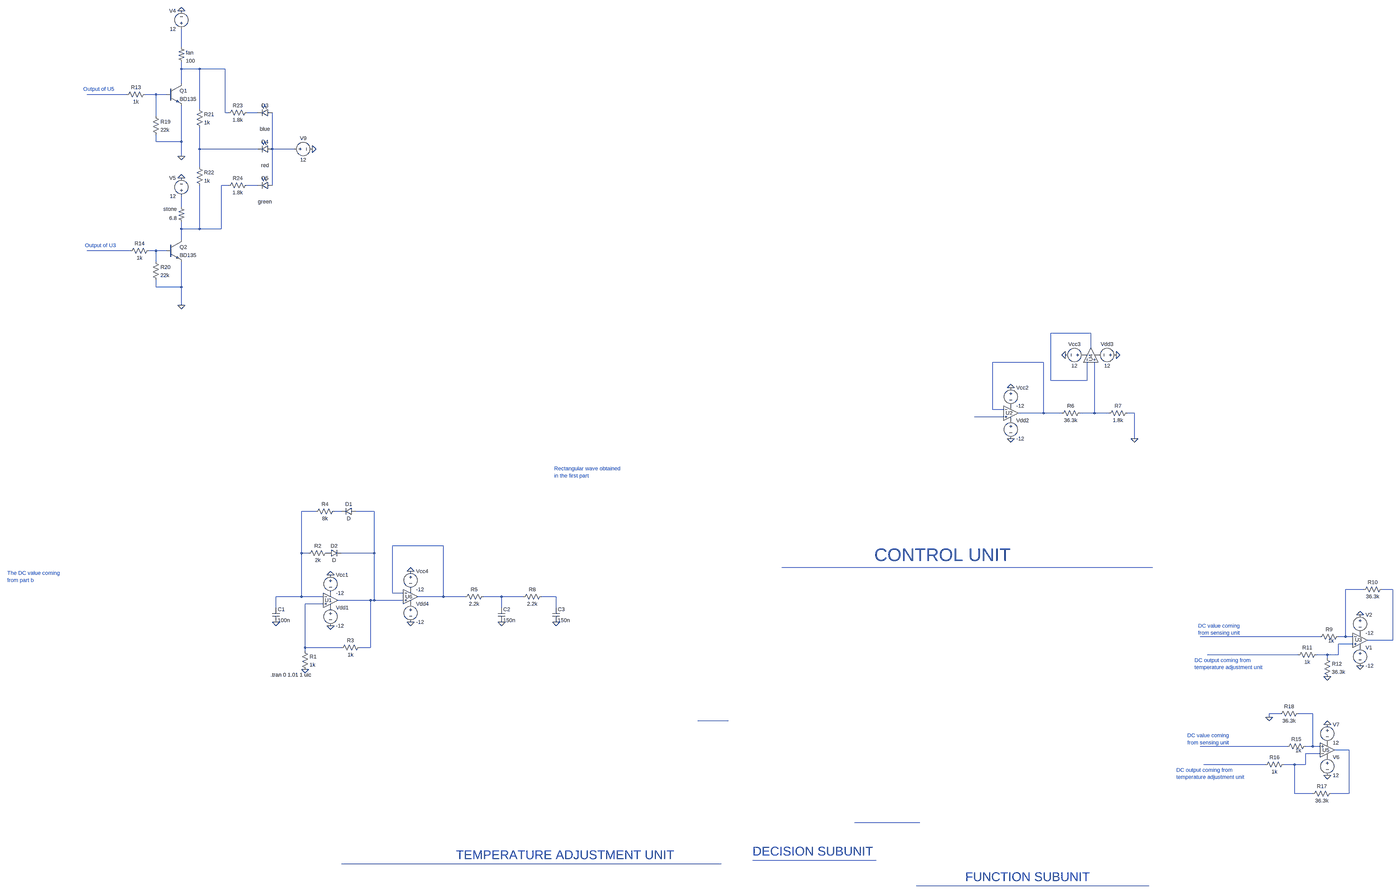
[diagram p0: schematic Draft1.asc, whole sheet]
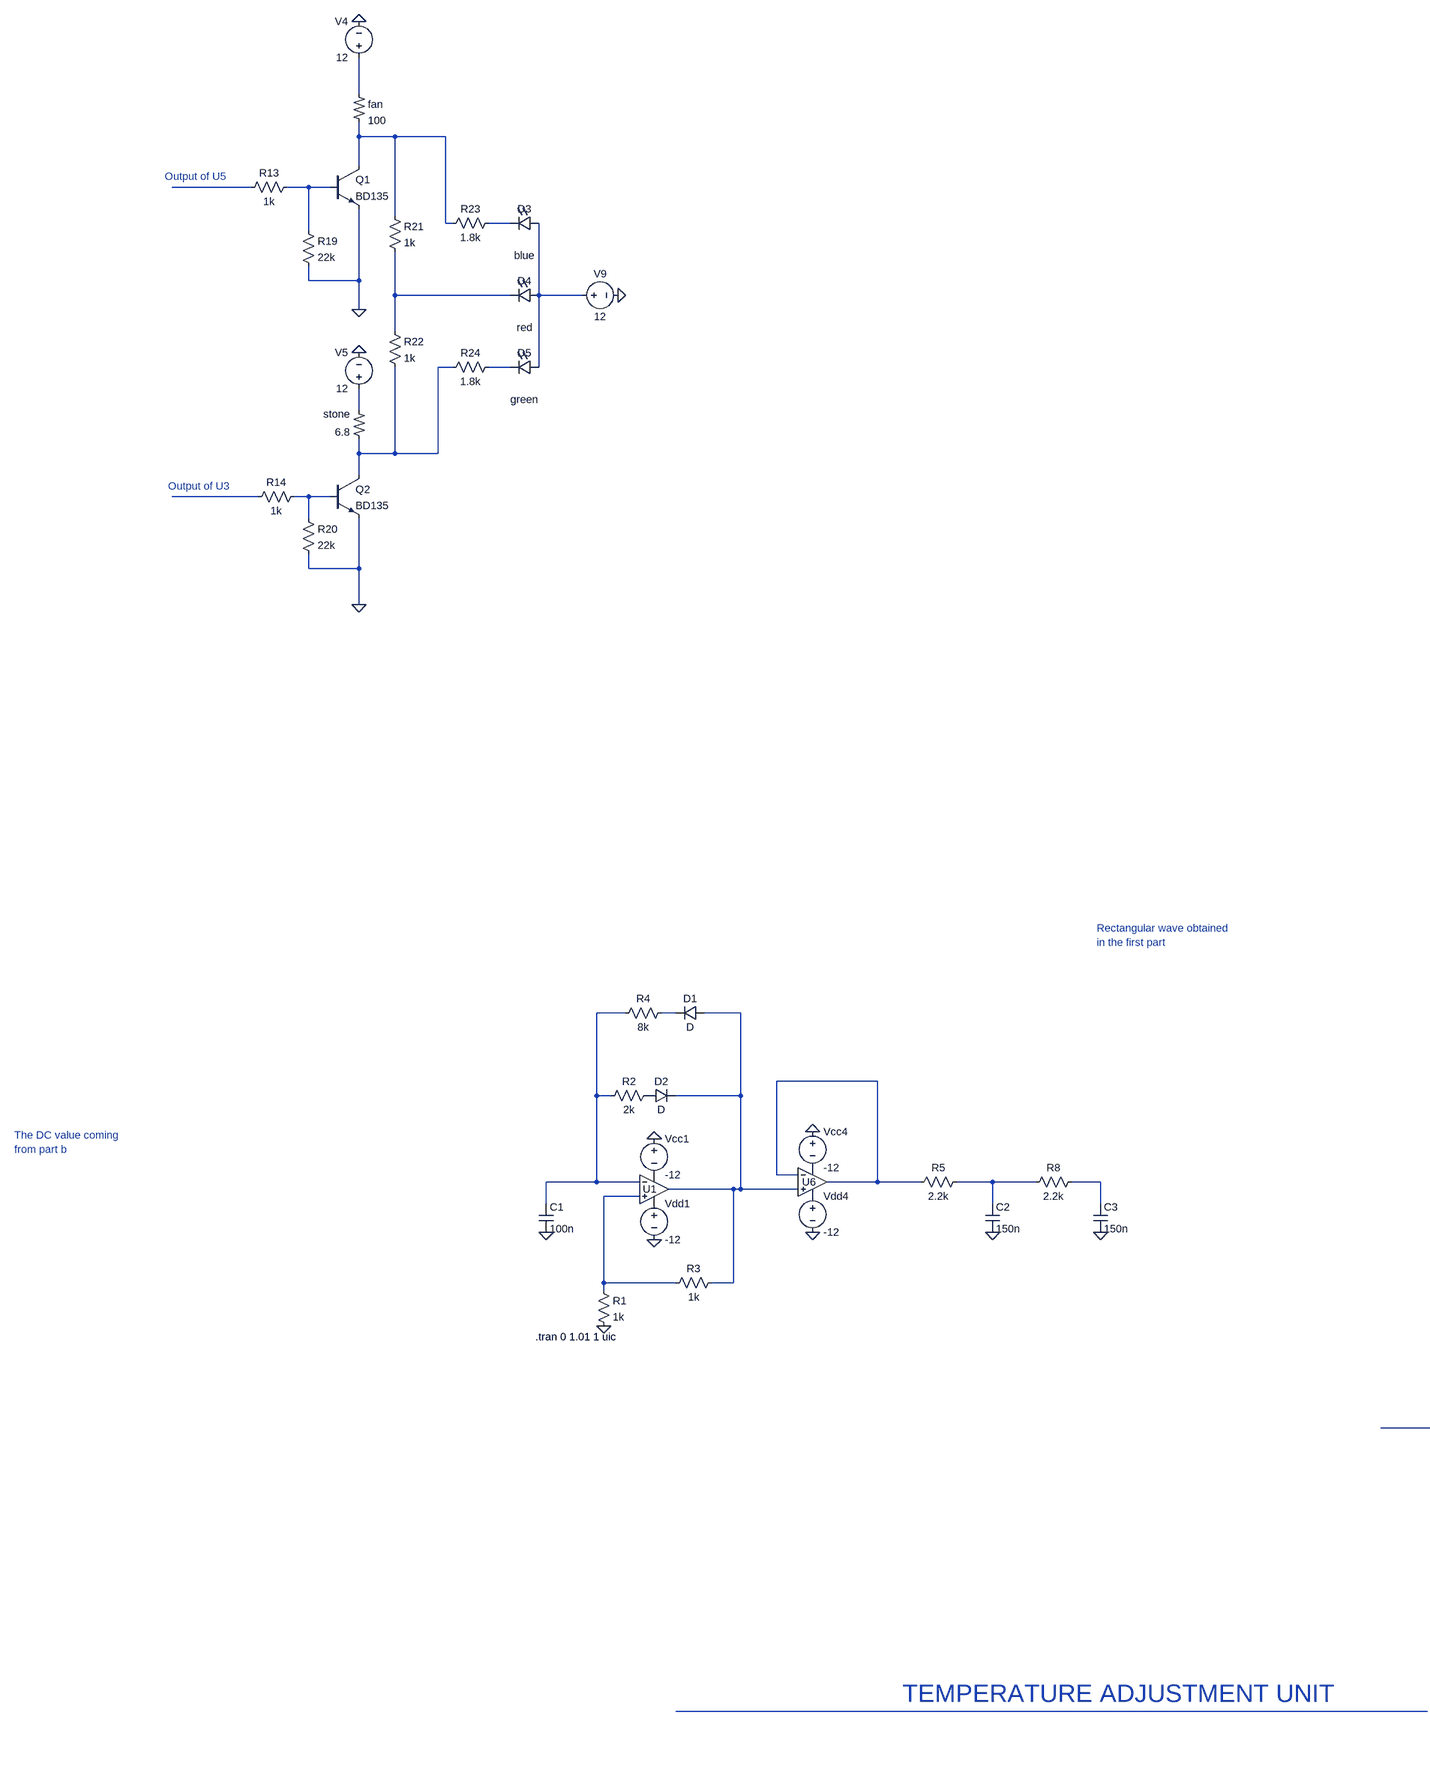
[diagram p1: schematic Draft1.asc, part, row 1 of 1, column 1 of 2]
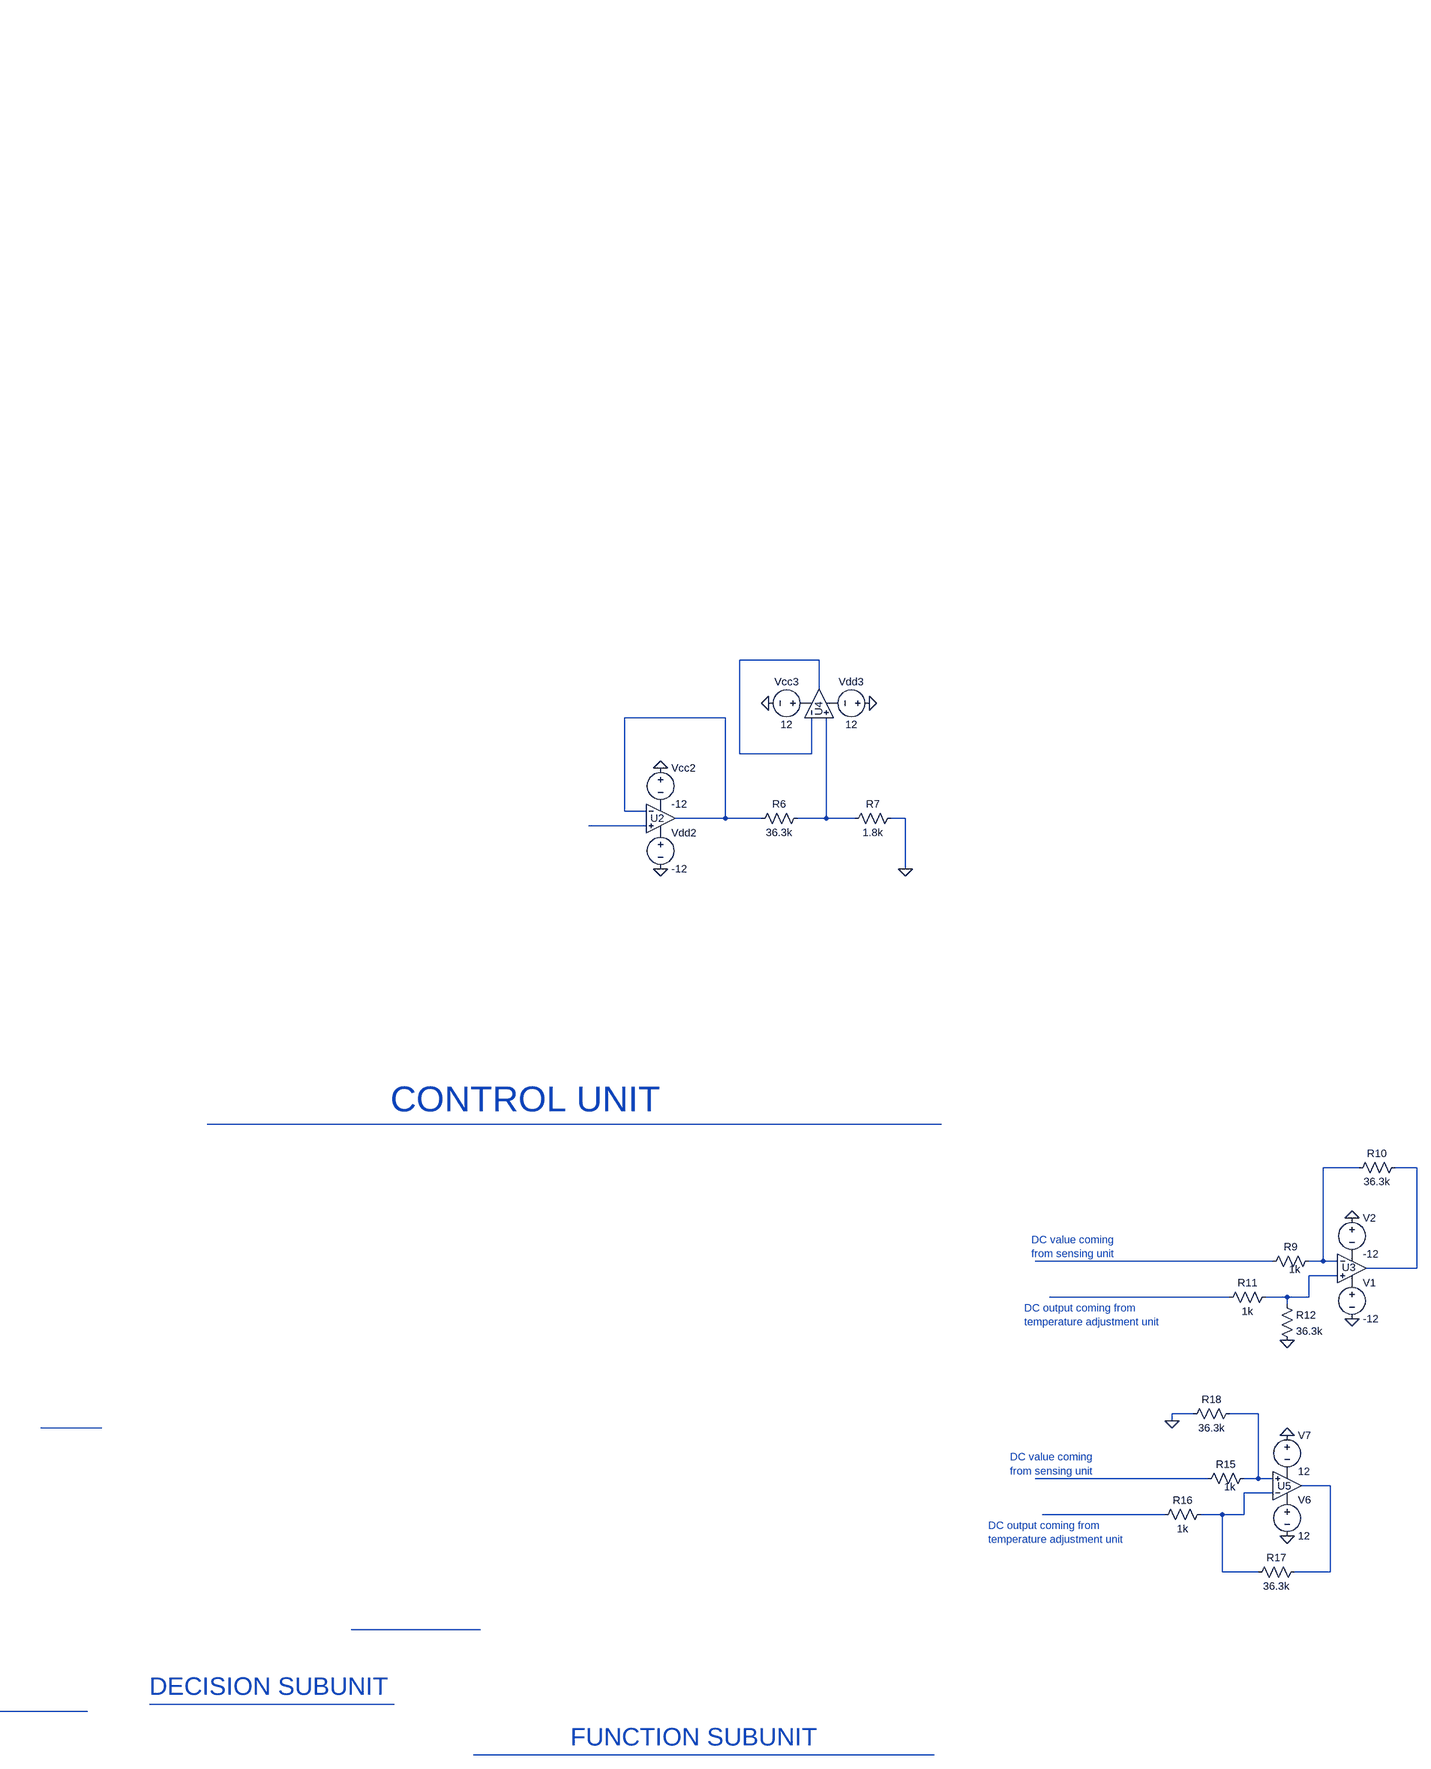
[diagram p2: schematic Draft1.asc, part, row 1 of 1, column 2 of 2]
Draft1.asc, the LTspice schematic file:
Version 4
SHEET 1 6084 680
WIRE -1712 -4704 -1712 -4784
WIRE -1712 -4608 -1712 -4640
WIRE -1632 -4608 -1712 -4608
WIRE -1520 -4608 -1632 -4608
WIRE -1712 -4544 -1712 -4608
WIRE -1952 -4496 -2128 -4496
WIRE -1824 -4496 -1872 -4496
WIRE -1776 -4496 -1824 -4496
WIRE -1632 -4432 -1632 -4608
WIRE -1520 -4416 -1520 -4608
WIRE -1504 -4416 -1520 -4416
WIRE -1376 -4416 -1424 -4416
WIRE -1824 -4400 -1824 -4496
WIRE -1824 -4288 -1824 -4320
WIRE -1712 -4288 -1712 -4448
WIRE -1712 -4288 -1824 -4288
WIRE -1632 -4256 -1632 -4352
WIRE -1376 -4256 -1632 -4256
WIRE -1312 -4256 -1312 -4416
WIRE -1216 -4256 -1312 -4256
WIRE -1712 -4224 -1712 -4288
WIRE -1632 -4176 -1632 -4256
WIRE -1504 -4096 -1536 -4096
WIRE -1376 -4096 -1424 -4096
WIRE -1312 -4096 -1312 -4256
WIRE -1712 -4000 -1712 -4048
WIRE -1712 -3904 -1712 -3936
WIRE -1632 -3904 -1632 -4096
WIRE -1632 -3904 -1712 -3904
WIRE -1536 -3904 -1536 -4096
WIRE -1536 -3904 -1632 -3904
WIRE -1712 -3856 -1712 -3904
WIRE -1936 -3808 -2128 -3808
WIRE -1824 -3808 -1856 -3808
WIRE -1776 -3808 -1824 -3808
WIRE -1824 -3760 -1824 -3808
WIRE -1824 -3648 -1824 -3680
WIRE -1712 -3648 -1712 -3760
WIRE -1712 -3648 -1824 -3648
WIRE -1712 -3568 -1712 -3648
WIRE 2640 -3440 2464 -3440
WIRE 2640 -3376 2640 -3440
WIRE 2432 -3312 2208 -3312
WIRE 2464 -3232 2464 -3440
WIRE 2624 -3232 2624 -3312
WIRE 2624 -3232 2464 -3232
WIRE 2208 -3104 2208 -3312
WIRE 2256 -3104 2208 -3104
WIRE 2432 -3088 2432 -3312
WIRE 2432 -3088 2320 -3088
WIRE 2512 -3088 2432 -3088
WIRE 2656 -3088 2656 -3312
WIRE 2656 -3088 2592 -3088
WIRE 2720 -3088 2656 -3088
WIRE 2832 -3088 2800 -3088
WIRE 2256 -3072 2128 -3072
WIRE 2832 -2976 2832 -3088
WIRE -1120 -1744 -1184 -1744
WIRE -1008 -1744 -1040 -1744
WIRE -864 -1744 -944 -1744
WIRE -560 -1584 -784 -1584
WIRE -1184 -1552 -1184 -1744
WIRE -1152 -1552 -1184 -1552
WIRE -864 -1552 -864 -1744
WIRE -864 -1552 -1008 -1552
WIRE 2912 -1488 1280 -1488
WIRE 5952 -1392 5872 -1392
WIRE 6080 -1392 6032 -1392
WIRE -784 -1376 -784 -1584
WIRE -736 -1376 -784 -1376
WIRE -1184 -1360 -1184 -1552
WIRE -1184 -1360 -1296 -1360
WIRE -1088 -1360 -1184 -1360
WIRE -560 -1360 -560 -1584
WIRE -560 -1360 -672 -1360
WIRE -464 -1360 -560 -1360
WIRE -304 -1360 -384 -1360
WIRE -208 -1360 -304 -1360
WIRE -64 -1360 -128 -1360
WIRE -880 -1344 -1024 -1344
WIRE -864 -1344 -864 -1552
WIRE -864 -1344 -880 -1344
WIRE -736 -1344 -864 -1344
WIRE -1088 -1328 -1168 -1328
WIRE -1296 -1312 -1296 -1360
WIRE -304 -1312 -304 -1360
WIRE -64 -1312 -64 -1360
WIRE 5760 -1184 5232 -1184
WIRE 5872 -1184 5872 -1392
WIRE 5872 -1184 5840 -1184
WIRE 5904 -1184 5872 -1184
WIRE 6080 -1168 6080 -1392
WIRE 6080 -1168 5968 -1168
WIRE 5904 -1152 5840 -1152
WIRE -1168 -1136 -1168 -1328
WIRE -1008 -1136 -1168 -1136
WIRE -880 -1136 -880 -1344
WIRE -880 -1136 -928 -1136
WIRE -1168 -1120 -1168 -1136
WIRE 5664 -1104 5264 -1104
WIRE 5792 -1104 5744 -1104
WIRE 5840 -1104 5840 -1152
WIRE 5840 -1104 5792 -1104
WIRE 5792 -1088 5792 -1104
WIRE 5584 -800 5536 -800
WIRE 5728 -800 5664 -800
WIRE 5536 -784 5536 -800
WIRE 848 -768 592 -768
WIRE 5616 -656 5232 -656
WIRE 5728 -656 5728 -800
WIRE 5728 -656 5696 -656
WIRE 5760 -656 5728 -656
WIRE 5888 -640 5824 -640
WIRE 5760 -624 5696 -624
WIRE 5520 -576 5248 -576
WIRE 5648 -576 5600 -576
WIRE 5696 -576 5696 -624
WIRE 5696 -576 5648 -576
WIRE 5648 -448 5648 -576
WIRE 5728 -448 5648 -448
WIRE 5888 -448 5888 -640
WIRE 5888 -448 5808 -448
WIRE 1888 -320 1600 -320
WIRE 1696 -64 1152 -64
WIRE 816 -48 -1008 -48
WIRE 2896 48 1872 48
FLAG -1056 -1456 0
FLAG -1056 -1232 0
FLAG -1168 -1040 0
FLAG -1296 -1248 0
FLAG -304 -1248 0
FLAG 2288 -2976 0
FLAG 2288 -3200 0
FLAG 2832 -2976 0
FLAG -64 -1248 0
FLAG 5936 -1280 0
FLAG 5936 -1056 0
FLAG 2528 -3344 0
FLAG 2752 -3344 0
FLAG -1712 -4864 0
FLAG -1712 -4224 0
FLAG -1712 -3568 0
FLAG -1712 -4128 0
FLAG 5792 -752 0
FLAG 5792 -528 0
FLAG 5792 -1008 0
FLAG 5536 -784 0
FLAG -704 -1248 0
FLAG -704 -1472 0
FLAG -1136 -4256 0
SYMBOL Opamps\\UniversalOpamp2 -1056 -1344 R0
WINDOW 0 -25 0 Left 2
SYMATTR InstName U1
SYMBOL voltage -1056 -1328 R0
WINDOW 123 0 0 Left 2
WINDOW 39 0 0 Left 2
SYMATTR InstName Vdd1
SYMATTR Value -12
SYMBOL voltage -1056 -1472 R0
WINDOW 123 0 0 Left 2
WINDOW 39 0 0 Left 2
SYMATTR InstName Vcc1
SYMATTR Value -12
SYMBOL cap -1312 -1312 R0
SYMATTR InstName C1
SYMATTR Value 100n
SYMBOL res -1184 -1136 R0
SYMATTR InstName R1
SYMATTR Value 1k
SYMBOL res -1056 -1568 R90
WINDOW 0 0 56 VBottom 2
WINDOW 3 32 56 VTop 2
SYMATTR InstName R2
SYMATTR Value 2k
SYMBOL res -912 -1152 R90
WINDOW 0 0 56 VBottom 2
WINDOW 3 32 56 VTop 2
SYMATTR InstName R3
SYMATTR Value 1k
SYMBOL diode -944 -1760 R90
WINDOW 0 0 32 VBottom 2
WINDOW 3 32 32 VTop 2
SYMATTR InstName D1
SYMBOL diode -1072 -1536 R270
WINDOW 0 32 32 VTop 2
WINDOW 3 0 32 VBottom 2
SYMATTR InstName D2
SYMBOL res -1024 -1760 R90
WINDOW 0 0 56 VBottom 2
WINDOW 3 32 56 VTop 2
SYMATTR InstName R4
SYMATTR Value 8k
SYMBOL res -368 -1376 R90
WINDOW 0 0 56 VBottom 2
WINDOW 3 32 56 VTop 2
SYMATTR InstName R5
SYMATTR Value 2.2k
SYMBOL cap -320 -1312 R0
SYMATTR InstName C2
SYMATTR Value 150n
SYMBOL Opamps\\UniversalOpamp2 2288 -3088 R0
WINDOW 0 -23 0 Left 2
SYMATTR InstName U2
SYMBOL voltage 2288 -3072 R0
WINDOW 123 0 0 Left 2
WINDOW 39 0 0 Left 2
SYMATTR InstName Vdd2
SYMATTR Value -12
SYMBOL voltage 2288 -3216 R0
WINDOW 123 0 0 Left 2
WINDOW 39 0 0 Left 2
SYMATTR InstName Vcc2
SYMATTR Value -12
SYMBOL res 2608 -3104 R90
WINDOW 0 0 56 VBottom 2
WINDOW 3 32 56 VTop 2
SYMATTR InstName R6
SYMATTR Value 36.3k
SYMBOL res 2816 -3104 R90
WINDOW 0 0 56 VBottom 2
WINDOW 3 32 56 VTop 2
SYMATTR InstName R7
SYMATTR Value 1.8k
SYMBOL res -112 -1376 R90
WINDOW 0 0 56 VBottom 2
WINDOW 3 32 56 VTop 2
SYMATTR InstName R8
SYMATTR Value 2.2k
SYMBOL cap -80 -1312 R0
SYMATTR InstName C3
SYMATTR Value 150n
SYMBOL Opamps\\UniversalOpamp2 5936 -1168 R0
WINDOW 0 -22 -2 Left 2
SYMATTR InstName U3
SYMBOL res 5856 -1200 R90
WINDOW 0 0 56 VBottom 2
WINDOW 3 19 47 VTop 2
SYMATTR InstName R9
SYMATTR Value 1k
SYMBOL voltage 5936 -1152 R0
WINDOW 123 0 0 Left 2
WINDOW 39 0 0 Left 2
SYMATTR InstName V1
SYMATTR Value -12
SYMBOL voltage 5936 -1296 R0
WINDOW 123 0 0 Left 2
WINDOW 39 0 0 Left 2
SYMATTR InstName V2
SYMATTR Value -12
SYMBOL res 6048 -1408 R90
WINDOW 0 0 56 VBottom 2
WINDOW 3 32 56 VTop 2
SYMATTR InstName R10
SYMATTR Value 36.3k
SYMBOL res 5760 -1120 R90
WINDOW 0 0 56 VBottom 2
WINDOW 3 32 56 VTop 2
SYMATTR InstName R11
SYMATTR Value 1k
SYMBOL npn -1776 -4544 R0
SYMATTR InstName Q1
SYMATTR Value BD135
SYMBOL npn -1776 -3856 R0
SYMATTR InstName Q2
SYMATTR Value BD135
SYMBOL Opamps\\UniversalOpamp2 2640 -3344 R270
WINDOW 0 -28 0 Left 2
SYMATTR InstName U4
SYMBOL voltage 2624 -3344 R90
WINDOW 0 -32 56 VBottom 2
WINDOW 3 32 56 VTop 2
WINDOW 123 0 0 Left 2
WINDOW 39 0 0 Left 2
SYMATTR InstName Vcc3
SYMATTR Value 12
SYMBOL voltage 2768 -3344 R90
WINDOW 0 -32 56 VBottom 2
WINDOW 3 32 56 VTop 2
WINDOW 123 0 0 Left 2
WINDOW 39 0 0 Left 2
SYMATTR InstName Vdd3
SYMATTR Value 12
SYMBOL res 5776 -1104 R0
SYMATTR InstName R12
SYMATTR Value 36.3k
SYMBOL res -1856 -4512 R90
WINDOW 0 0 56 VBottom 2
WINDOW 3 32 56 VTop 2
SYMATTR InstName R13
SYMATTR Value 1k
SYMBOL res -1952 -3792 R270
WINDOW 0 32 56 VTop 2
WINDOW 3 0 56 VBottom 2
SYMATTR InstName R14
SYMATTR Value 1k
SYMBOL voltage -1712 -4768 R180
WINDOW 0 24 96 Left 2
WINDOW 3 24 16 Left 2
WINDOW 123 0 0 Left 2
WINDOW 39 0 0 Left 2
SYMATTR InstName V4
SYMATTR Value 12
SYMBOL res2 -1696 -3936 R180
WINDOW 0 36 56 Left 2
WINDOW 3 36 16 Left 2
SYMATTR InstName stone
SYMATTR Value 6.8
SYMBOL voltage -1712 -4032 R180
WINDOW 0 24 96 Left 2
WINDOW 3 24 16 Left 2
WINDOW 123 0 0 Left 2
WINDOW 39 0 0 Left 2
SYMATTR InstName V5
SYMATTR Value 12
SYMBOL Opamps\\UniversalOpamp2 5792 -640 M180
WINDOW 0 -22 -1 Left 2
SYMATTR InstName U5
SYMBOL res 5712 -672 R90
WINDOW 0 0 56 VBottom 2
WINDOW 3 19 47 VTop 2
SYMATTR InstName R15
SYMATTR Value 1k
SYMBOL voltage 5792 -624 R0
WINDOW 123 0 0 Left 2
WINDOW 39 0 0 Left 2
SYMATTR InstName V6
SYMATTR Value 12
SYMBOL voltage 5792 -768 R0
WINDOW 123 0 0 Left 2
WINDOW 39 0 0 Left 2
SYMATTR InstName V7
SYMATTR Value 12
SYMBOL res 5616 -592 R90
WINDOW 0 0 56 VBottom 2
WINDOW 3 32 56 VTop 2
SYMATTR InstName R16
SYMATTR Value 1k
SYMBOL res2 -1728 -4704 R0
SYMATTR InstName fan
SYMATTR Value 100
SYMBOL LED -1312 -4432 R90
WINDOW 0 0 32 VBottom 2
WINDOW 3 72 32 VTop 2
SYMATTR InstName D3
SYMATTR Value blue
SYMBOL LED -1312 -4272 R90
WINDOW 0 0 32 VBottom 2
WINDOW 3 72 32 VTop 2
SYMATTR InstName D4
SYMATTR Value red
SYMBOL LED -1312 -4112 R90
WINDOW 0 0 32 VBottom 2
WINDOW 3 72 32 VTop 2
SYMATTR InstName D5
SYMATTR Value green
SYMBOL res 5824 -464 R90
WINDOW 0 0 56 VBottom 2
WINDOW 3 32 56 VTop 2
SYMATTR InstName R17
SYMATTR Value 36.3k
SYMBOL res 5680 -816 R90
WINDOW 0 0 56 VBottom 2
WINDOW 3 32 56 VTop 2
SYMATTR InstName R18
SYMATTR Value 36.3k
SYMBOL Opamps\\UniversalOpamp2 -704 -1360 R0
WINDOW 0 -23 0 Left 2
SYMATTR InstName U6
SYMBOL voltage -704 -1344 R0
WINDOW 123 0 0 Left 2
WINDOW 39 0 0 Left 2
SYMATTR InstName Vdd4
SYMATTR Value -12
SYMBOL voltage -704 -1488 R0
WINDOW 123 0 0 Left 2
WINDOW 39 0 0 Left 2
SYMATTR InstName Vcc4
SYMATTR Value -12
SYMBOL res -1840 -4416 R0
SYMATTR InstName R19
SYMATTR Value 22k
SYMBOL res -1840 -3776 R0
SYMATTR InstName R20
SYMATTR Value 22k
SYMBOL voltage -1232 -4256 R270
WINDOW 0 32 56 VTop 2
WINDOW 3 -32 56 VBottom 2
WINDOW 123 0 0 Left 2
WINDOW 39 0 0 Left 2
SYMATTR InstName V9
SYMATTR Value 12
SYMBOL res -1648 -4448 R0
SYMATTR InstName R21
SYMATTR Value 1k
SYMBOL res -1648 -4192 R0
SYMATTR InstName R22
SYMATTR Value 1k
SYMBOL res -1408 -4432 R90
WINDOW 0 0 56 VBottom 2
WINDOW 3 32 56 VTop 2
SYMATTR InstName R23
SYMATTR Value 1.8k
SYMBOL res -1408 -4112 R90
WINDOW 0 0 56 VBottom 2
WINDOW 3 32 56 VTop 2
SYMATTR InstName R24
SYMATTR Value 1.8k
TEXT -1320 -1016 Left 2 !.tran 0 1.01 1 uic
TEXT -72 -2264 Left 2 ;Rectangular wave obtained\nin the first part
TEXT -2688 -1464 Left 2 ;The DC value coming\nfrom part b
TEXT -504 -88 Left 5 ;TEMPERATURE ADJUSTMENT UNIT
TEXT 1152 -104 Left 5 ;DECISION SUBUNIT
TEXT 2088 8 Left 5 ;FUNCTION SUBUNIT
TEXT 1688 -1544 Left 6 ;CONTROL UNIT
TEXT 5208 -1080 Left 2 ;DC output coming from \ntemperature adjustment unit
TEXT 5128 -552 Left 2 ;DC output coming from \ntemperature adjustment unit
TEXT 5224 -1232 Left 2 ;DC value coming \nfrom sensing unit
TEXT 5176 -704 Left 2 ;DC value coming \nfrom sensing unit
TEXT -2144 -4520 Left 2 ;Output of U5
TEXT -2136 -3832 Left 2 ;Output of U3

The netlist it stands for:
* Draft1.asc
XU1 N026 N017 P001 P002 N019 level.2 Avol=1Meg GBW=10Meg Slew=10Meg ilimit=25m rail=0 Vos=0 phimargin=45 en=0 enk=0 in=0 ink=0 Rin=500Meg  ; pins IN+ IN- V+ V- OUT
Vdd1 P002 0 -12
Vcc1 0 P001 -12
C1 N017 0 100n
R1 N026 0 1k
R2 P003 N017 2k
R3 N019 N026 1k
D1 N019 N018 D
D2 P003 N019 D
R4 N018 N017 8k
R5 N024 N020 2.2k
C2 N024 0 150n
XU2 N016 N014 P004 P005 N014 level.2 Avol=1Meg GBW=10Meg Slew=10Meg ilimit=25m rail=0 Vos=0 phimargin=45 en=0 enk=0 in=0 ink=0 Rin=500Meg  ; pins IN+ IN- V+ V- OUT
Vdd2 P005 0 -12
Vcc2 0 P004 -12
R6 N015 N014 36.3k
R7 0 N015 1.8k
R8 N025 N024 2.2k
C3 N025 0 150n
XU3 N028 N022 P006 P007 N023 level.2 Avol=1Meg GBW=10Meg Slew=10Meg ilimit=25m rail=0 Vos=0 phimargin=45 en=0 enk=0 in=0 ink=0 Rin=500Meg  ; pins IN+ IN- V+ V- OUT
R9 N022 N027 1k
V1 P007 0 -12
V2 0 P006 -12
R10 N023 N022 36.3k
R11 N028 N029 1k
Q1 N002 N004 0 0 BD135
Q2 N008 N012 0 0 BD135
XU4 N015 N013 P008 P009 N013 level.2 Avol=1Meg GBW=10Meg Slew=10Meg ilimit=25m rail=0 Vos=0 phimargin=45 en=0 enk=0 in=0 ink=0 Rin=500Meg  ; pins IN+ IN- V+ V- OUT
Vcc3 P008 0 12
Vdd3 0 P009 12
R12 N028 0 36.3k
R13 N004 N003 1k
R14 N011 N012 1k
V4 N001 0 12
R§stone N008 N010 6.8
V5 N010 0 12
XU5 N030 N034 P010 P011 N033 level.2 Avol=1Meg GBW=10Meg Slew=10Meg ilimit=25m rail=0 Vos=0 phimargin=45 en=0 enk=0 in=0 ink=0 Rin=500Meg  ; pins IN+ IN- V+ V- OUT
R15 N030 N032 1k
V6 P010 0 12
V7 0 P011 12
R16 N034 N035 1k
R§fan N001 N002 100
D3 N007 N005 blue
D4 N007 N006 red
D5 N007 N009 green
R17 N033 N034 36.3k
R18 N030 0 36.3k
XU6 N019 N020 P012 P013 N020 level.2 Avol=1Meg GBW=10Meg Slew=10Meg ilimit=25m rail=0 Vos=0 phimargin=45 en=0 enk=0 in=0 ink=0 Rin=500Meg  ; pins IN+ IN- V+ V- OUT
Vdd4 P013 0 -12
Vcc4 0 P012 -12
R19 N004 0 22k
R20 N012 0 22k
V9 N007 0 12
R21 N002 N006 1k
R22 N006 N008 1k
R23 N005 N002 1.8k
R24 N009 N008 1.8k
.model D D
.lib standard.dio
.model NPN NPN
.model PNP PNP
.lib standard.bjt
.tran 0 1.01 1 uic
* Rectangular wave obtained
* in the first part
* The DC value coming
* from part b
* TEMPERATURE ADJUSTMENT UNIT
* DECISION SUBUNIT
* FUNCTION SUBUNIT
* CONTROL UNIT
* DC output coming from
* temperature adjustment unit
* DC output coming from
* temperature adjustment unit
* DC value coming
* from sensing unit
* DC value coming
* from sensing unit
* Output of U5
* Output of U3
.lib UniversalOpamps2.sub
.backanno
.end